# EAGLE design TSSP Mini Board (EAGLE 8.6.0)
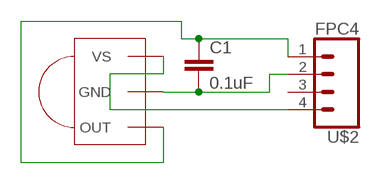
[diagram p0: schematic, sheet 1]

## Parts
C1  0.1uF  0.1UF-0603-25V-5%  [0603]
U$1  TSSP58038  [MINICAST]
U$2  FPC4  [FPC4]

## Nets
N$1: C1.1 U$1.1(OUT) U$2.1
N$2: C1.2 U$1.2(GND) U$2.2
N$3: U$1.3(VS) U$2.4
Unconnected: U$2.3

## Library data of the parts
C1 = SparkFun-Capacitors:0.1UF: 0.1µF ceramic capacitors A capacitor is a passive two-terminal electrical component used to store electrical energy temporarily in an electric field.; PROD_ID: CAP-08604
U$1 = IR Receivers:TSSP58038: IR Receiver Module for Light Barrier Systems datasheet <http://www.vishay.com/docs/82479/tssp58038.pdf>
U$2 = FFC:FPC4: 4Pin FPC Connector 1mm Pitch datasheet <https://au.mouser.com/ds/2/418/NG_CD_84953_A3-1262712.pdf>

## Board
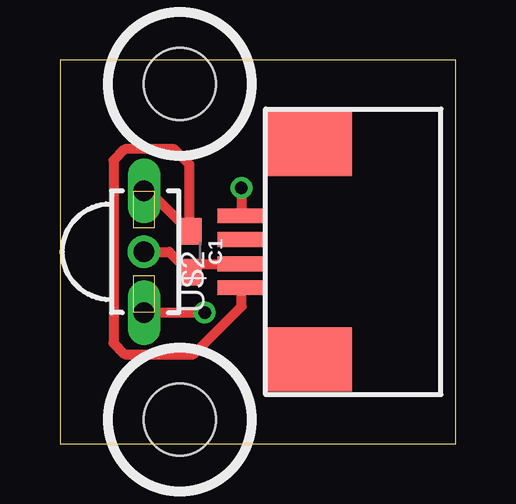
[diagram p1: board, top side]
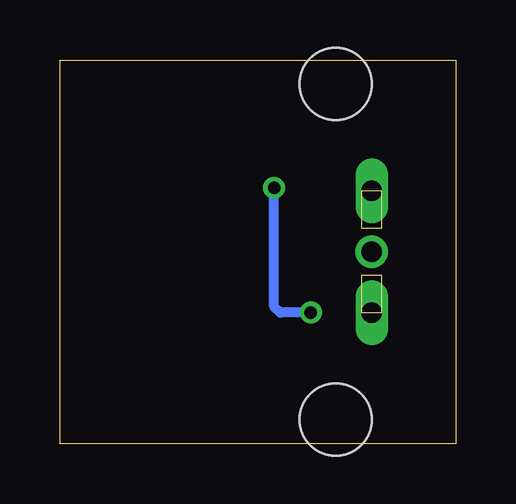
[diagram p2: board, bottom side, seen from below]

Size 16.5 x 16 mm. Coordinates in mm from the lower left corner, seen from the top.
Outline: 0,16 0,0 16.5,0 16.5,16 0,16
Copper layers (1*16): Top 0.035mm / dielectric 1.5mm / Bottom 0.035mm
Design rules "default": minimum track width 6mil, minimum drill 0.35mm, track to track 6mil, track to pad 6mil, pad to pad 6mil, via to via 6mil, smd to smd 6mil, copper to edge 40mil, drill to drill 6mil, minimum pad ring 10mil, minimum via ring 8mil, stop-mask expansion 4mil, vias tented up to drill 0mil, thermal gap 10mil
Holes 3 mm at 5,15 5,1

### Footprints (pad centres in the part's own frame; a part is rotated, then mirrored left to right if it is on the bottom)
0603 = smd 1.1 x 1: 1 -0.85,0; 2 0.85,0
MINICAST = drill 0.85 long: 1 0,2.54; 3 0,-2.54 | drill 0.85: 2 0,0
FPC4 = smd 0.61 x 2.007: 1 -1.499,1.003; 2 -0.508,1.003; 3 0.508,1.003; 4 1.499,1.003 | smd 2.667 x 3.607: P$5 -4.483,-1.803; P$6 4.483,-1.803

### Placement (x,y rotation side)
C1  5.41,8 270 top
U$1  3.5,8 0 top
U$2  8.58,8 90 top

### Tracks (layer width: path | path; a pad name or v marks a point on that pad's centre or on a via)
N$1
  Top 0.406: U$1.1 3.71,10.54 C1.1 5.41,11.65 4.77,12.28 2.7,12.28 2.23,11.81 2.23,4.19 2.7,3.72 5.57,3.72 7.58,5.73 U$2.1
N$2
  Top 0.406: U$1.2 4.55,8 C1.2 5.75,7.49 U$2.2
N$3  (via drill 0.51)
  Top 0.406: U$1.3 v6.04,5.46 | v7.56,10.67 7.58,10.65 U$2.4
  Bottom 0.406: v6.04,5.46 7.31,5.46 7.56,5.71 v7.56,10.67